# Altium schematic sheet tinyfl_v3_t.SchDoc
size A4
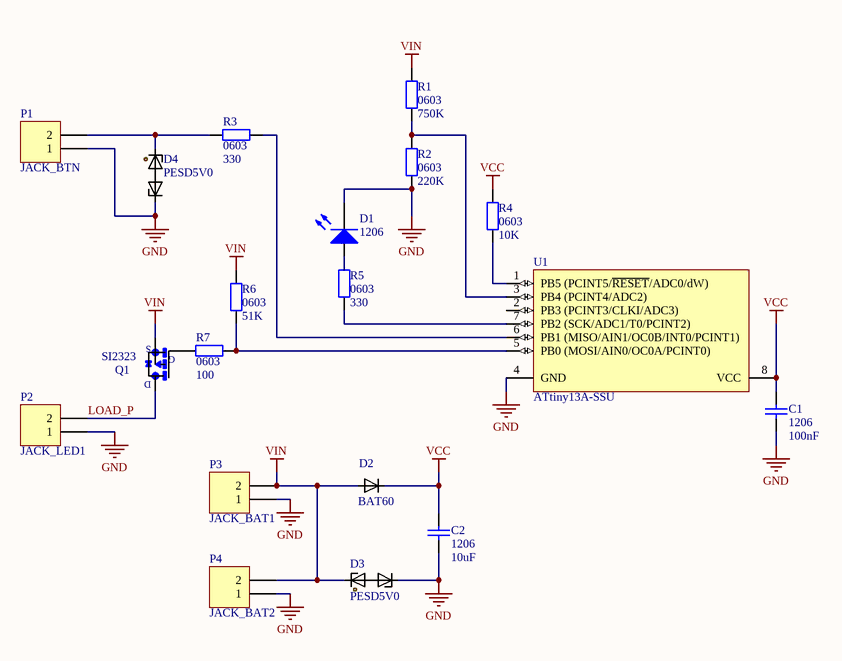
[diagram p0: tinyfl_v3_t.SchDoc]

## Parts
C1  1206  value 100nF  [C1206]
C2  1206  value 10uF  [C1206]
D1  1206  [C1206]
D2  BAT60  [*SOD323(F)]
D3  PESD5V0  [SOD-323]
D4  PESD5V0  [SOD-323]
P1  JACK_BTN  [HDR1X2]
P2  JACK_LED1  [HDR1X2]
P3  JACK_BAT1  [HDR1X2]
P4  JACK_BAT2  [HDR1X2]
Q1  SI2323  [SOT23]
R1  0603  value 750K  [1608[0603]]
R2  0603  value 220K  [1608[0603]]
R3  0603  value 330  [1608[0603]]
R4  0603  value 10K  [1608[0603]]
R5  0603  value 330  [1608[0603]]
R6  0603  value 51K  [1608[0603]]
R7  0603  value 100  [1608[0603]]
U1  ATtiny13A-SSU  [8S1_M]

## Nets
GND: C1.2 C2.2 D1.2(K) D3.2(K) D4.2(K) P1.1 P2.1 P3.1 P4.1 R2.2 U1.4(GND)
VCC: C1.1 C2.1 D2.1(K) R4.2 U1.8(VCC)
VIN: D2.2(A) D3.1(A) P3.2 P4.2 Q1.2(S) R1.1 R6.2
LOAD_P: P2.2 Q1.3(D)
NetD1_1: D1.1(A) R5.1
NetD4_1: D4.1(A) P1.2 R3.2
NetQ1_1: Q1.1(G) R7.2
NetR1_2: R1.2 R2.1 U1.3(PB4_(PCINT4/ADC2))
NetR3_1: R3.1 U1.6(PB1_(MISO/AIN1/OC0B/INT0/PCINT1))
NetR4_1: R4.1 U1.1(PB5_(PCINT5/~{RESET}/ADC0/dW))
NetR5_2: R5.2 U1.7(PB2_(SCK/ADC1/T0/PCINT2))
NetR6_1: R6.1 R7.1 U1.5(PB0_(MOSI/AIN0/OC0A/PCINT0))

Not connected (* = marked no-connect by the designer): U1 2(PB3_(PCINT3/CLKI/ADC3))

## Library data of the parts
C1 C2 = Cap: Capacitor; Published: 8-Jun-2000; LatestRevisionDate: 17-Jul-2002; LatestRevisionNote: Re-released for DXP Platform.; PackageReference: RAD-0.3; Publisher: Altium Limited; PackageDescription: Radial Cap, Thru-Hole; 2 Leads; 0.3 in Pin Spacing
D1 = LED2: Typical RED, GREEN, YELLOW, AMBER GaAs LED; Published: 8-Jun-2000; LatestRevisionDate: 17-Jul-2002; LatestRevisionNote: Re-released for DXP Platform.; PackageVersion: Feb-2002; PackageReference: 3.2X1.6X1.1; Publisher: Altium Limited; PackageDescription: SM LED; 2 Flat Leads
D2 = BAS316,135: Diode Switching 100V 0.25A 2-Pin SOD-323 T/R; MF: Nexperia USA; Availability: Unavailable; SnapEDA_Link: https://www.snapeda.com/parts/BAS316%2C135/Nexperia%20USA%20Inc./view-part/?ref=snap; Price: None; Package: SOD-323 NXP Semiconductors; MP: BAS316,135; Value: *
P1-P4 = Header 2: Header, 2-Pin; LatestRevisionDate: 17-Jul-2002; LatestRevisionNote: Re-released for DXP Platform.; Publisher: Altium Limited
Q1 = AO3401: P-CH SOT-23 Mosfet; MP: AO3401; Package: SOT-23-3 Vishay; Availability: Unavailable; Value: *
R1-R7 = Res2: Resistor; Published: 8-Jun-2000; LatestRevisionDate: 17-Jul-2002; LatestRevisionNote: Re-released for DXP Platform.; PackageReference: AXIAL-0.4; Publisher: Altium Limited; PackageDescription: Axial Device, Thru-Hole; 2 Leads; 0.4 in Pin Spacing
U1 = ATtiny13A-SSU: 8-bit AVR Microcontroller, 1.8-5.5V, 1KB Flash, 64 Bytes EEPROM, 64 Bytes SRAM, 8-pin SOIC, Industrial Grade (-40°C to 85°C), Pb-Free; Published: 1-Apr-2010; DatasheetVersion: revD, Nov-2009; PackageVersion: revC, Mar-2005; PackageReference: 8S1; Publisher: Altium Limited; PackageDescription: 8-Lead (0.150" Wide Body), Plastic Gull Wing Small Outline (JEDEC SOIC); Supplier 1: Digi-Key; Supplier Part Number 1: ATTINY13A-SSU-ND; Supplier 2: Farnell; Supplier Part Number 2: 1704567; Supplier 3: Mouser; Supplier Part Number 3: 556-ATTINY13A-SSU; Code_JEDEC: MS-012-AA; Code_IPC: SOIC127P600-8; ComponentLink1Description: Manufacturer Link; ComponentLink1URL: http://www.atmel.com/products/avr/default.asp?; ComponentLink2Description: ATtiny13A Datasheet; ComponentLink2URL: http://www.atmel.com/dyn/resources/prod_documents/doc8126.pdf; ComponentLink3Description: ATtiny13A Summary; ComponentLink3URL: http://www.atmel.com/dyn/resources/prod_documents/8126S.pdf; ComponentLink4Description: Atmel.com Home; ComponentLink4URL: http://www.atmel.com